# Altium schematic sheet bckpln.SchDoc
size A
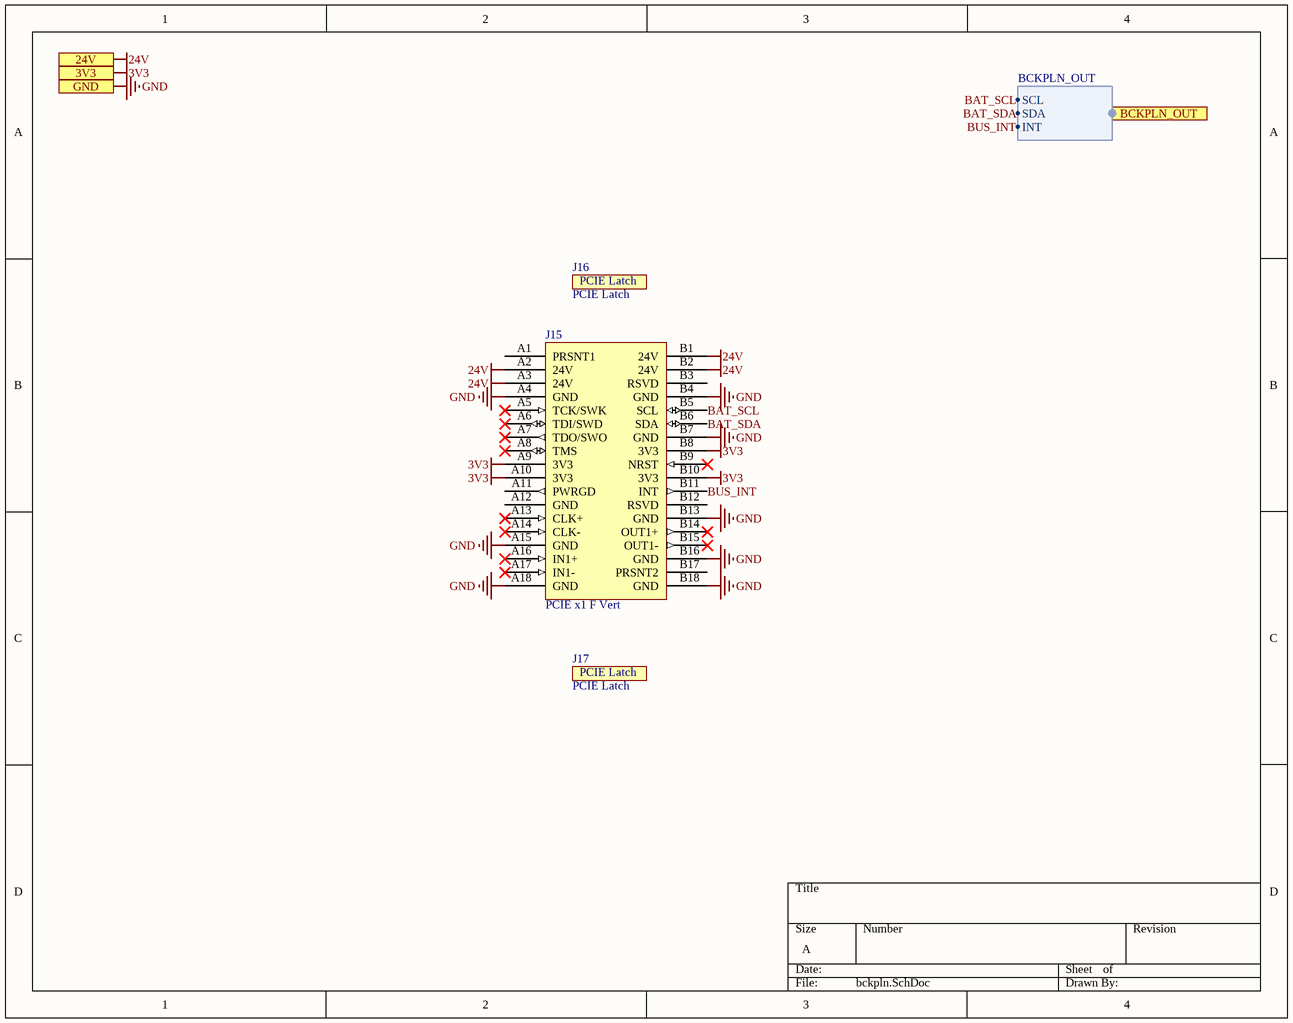
[diagram p0: bckpln.SchDoc]

## Parts
J15  PCIE x1 F Vert  [CONN PCIE x1 F Vert]
J16  PCIE Latch  [CONN PCIE F Latch]
J17  PCIE Latch  [CONN PCIE F Latch]

## Ports
3V3, 24V, BCKPLN_OUT (harness BCKPLN_OUT), GND

## Harnesses
BCKPLN_OUT: SCL, SDA, INT

## Nets
3V3: J15.A9(3V3) J15.A10(3V3) J15.B8(3V3) J15.B10(3V3) ; port 3V3
24V: J15.A2(24V) J15.A3(24V) J15.B1(24V) J15.B2(24V) ; port 24V
GND: J15.A4(GND) J15.A15(GND) J15.A18(GND) J15.B4(GND) J15.B7(GND) J15.B13(GND) J15.B16(GND) J15.B18(GND) ; port GND
BAT_SCL: J15.B5(SCL) ; port BCKPLN_OUT.SCL
BAT_SDA: J15.B6(SDA) ; port BCKPLN_OUT.SDA
BUS_INT: J15.B11(INT) ; port BCKPLN_OUT.INT

Not connected (* = marked no-connect by the designer): J15 A1(PRSNT1) A5(TCK/SWK)* A6(TDI/SWD)* A7(TDO/SWO)* A8(TMS)* A11(PWRGD) A12(GND) A13(CLK+)* A14(CLK-)* A16(IN1+)* A17(IN1-)* B3(RSVD) B9(NRST)* B12(RSVD) B14(OUT1+)* B15(OUT1-)* B17(PRSNT2)

## Library data of the parts
J15 = CONN PCIE x1 F Vert: 10018784-10210TLF; Supplier 1: Digi-Key; Supplier Part Number 1: 609-2029-ND
J16 J17 = CONN PCIE F Latch: CONN ACCY CARD RETENTION BLACK; Manufacturer 1: Amphenol FCI; Manufacturer Part Number 1: 10042618-003LF; Voltage Rating: 300V; Board Thickness: 1.57mm; Supplier 1: Digi-Key; RoHS: Yes; Category: Connectors; Stock 1: 31046; Pricing 1: 1=0.37000, 10=0.35400, 25=0.30320, 50=0.25780, 100=0.24770, 250=0.22244, 500=0.21232, 1000=0.17693, 2500=0.16176 (USD); Contact Material: Copper Alloy; Contact Plating: Tin; Housing Material: Nylon; Min Operating Temperature: -55°C; Max Operating Temperature: 85°C; Packaging: Bulk; Package Quantity: 300; Termination: Solder; Orientation: Straight; Length: 23.8mm; Height: 19mm; Depth: 16.21mm; Radiation Hardening: No; Lead Free: Lead Free; ComponentLink1URL: https://datasheet.ciiva.com/15207/getdatasheetpartid-305126-15207829.pdf?src-supplier=Verical; ComponentLink1Description: https://datasheet.ciiva.com/15207/getdatasheetpartid-305126-15207829.pdf?src-supplier=Verical; ComponentLink2URL: https://datasheet.ciiva.com/10954/10042618-10954687.pdf?src-supplier=Avnet; ComponentLink2Description: https://datasheet.ciiva.com/10954/10042618-10954687.pdf?src-supplier=Avnet; ComponentLink3URL: https://datasheet.ciiva.com/372/10042618-372637.pdf?src-supplier=Digi-Key; ComponentLink3Description: https://datasheet.ciiva.com/372/10042618-372637.pdf?src-supplier=Digi-Key; Supplier Part Number 1: 609-2061-ND